# Altium schematic sheet SwitchPower.SchDoc
size A
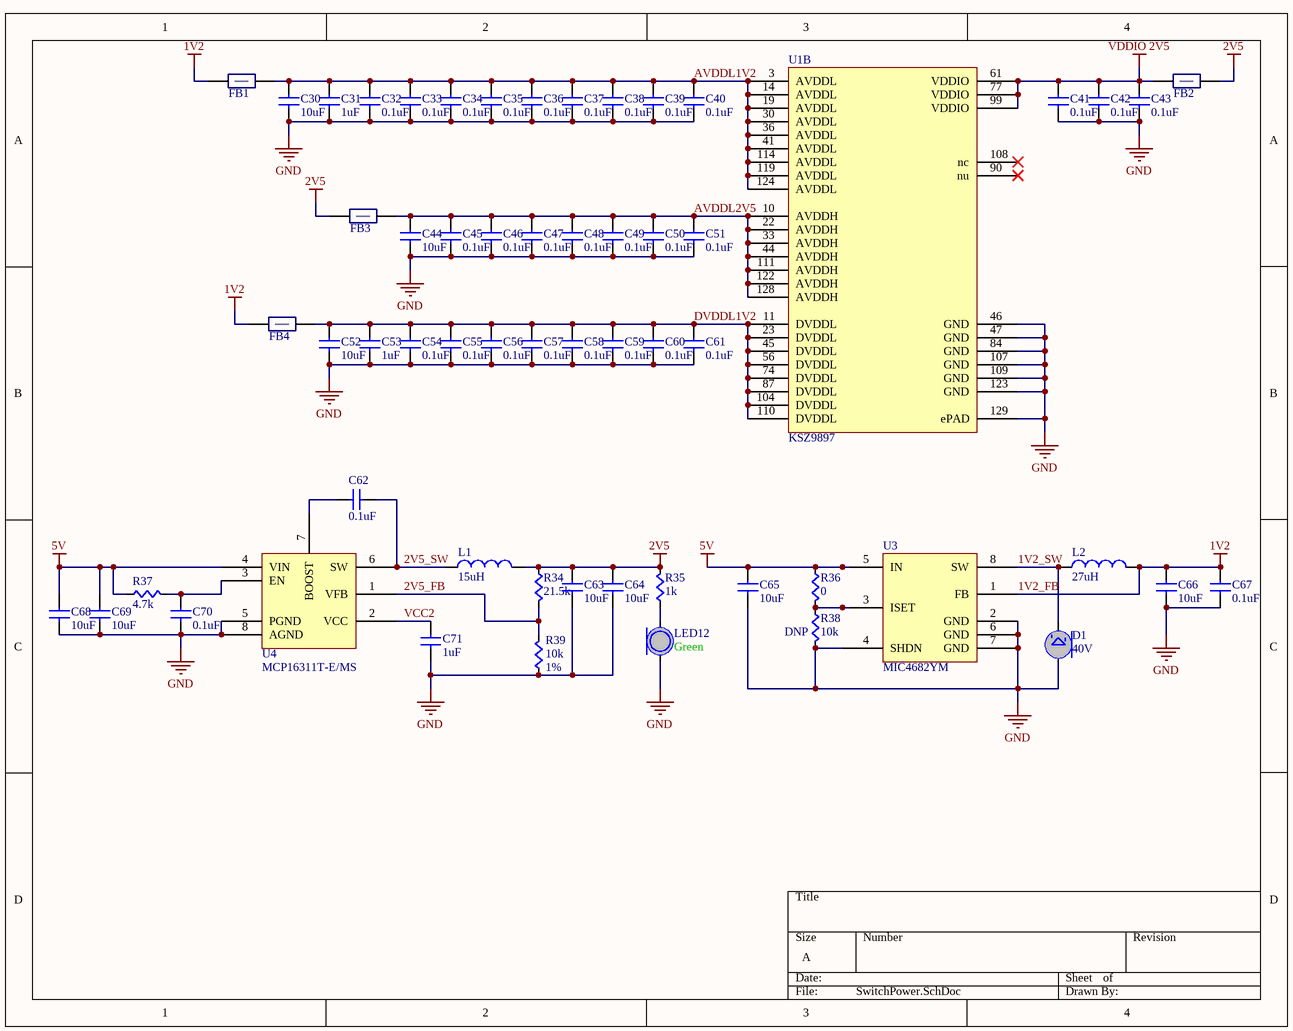
[diagram p0: SwitchPower.SchDoc]

## Parts
C30  value 10uF  [CAPC0603]  (hidden comment: Cap)
C31  value 1uF  [CAPC0603]  (hidden comment: Cap)
C32  value 0.1uF  [CAPC0603]  (hidden comment: Cap)
C33  value 0.1uF  [CAPC0603]  (hidden comment: Cap)
C34  value 0.1uF  [CAPC0603]  (hidden comment: Cap)
C35  value 0.1uF  [CAPC0603]  (hidden comment: Cap)
C36  value 0.1uF  [CAPC0603]  (hidden comment: Cap)
C37  value 0.1uF  [CAPC0603]  (hidden comment: Cap)
C38  value 0.1uF  [CAPC0603]  (hidden comment: Cap)
C39  value 0.1uF  [CAPC0603]  (hidden comment: Cap)
C40  value 0.1uF  [CAPC0603]  (hidden comment: Cap)
C41  value 0.1uF  [CAPC0603]  (hidden comment: Cap)
C42  value 0.1uF  [CAPC0603]  (hidden comment: Cap)
C43  value 0.1uF  [CAPC0603]  (hidden comment: Cap)
C44  value 10uF  [CAPC0603]  (hidden comment: Cap)
C45  value 0.1uF  [CAPC0603]  (hidden comment: Cap)
C46  value 0.1uF  [CAPC0603]  (hidden comment: Cap)
C47  value 0.1uF  [CAPC0603]  (hidden comment: Cap)
C48  value 0.1uF  [CAPC0603]  (hidden comment: Cap)
C49  value 0.1uF  [CAPC0603]  (hidden comment: Cap)
C50  value 0.1uF  [CAPC0603]  (hidden comment: Cap)
C51  value 0.1uF  [CAPC0603]  (hidden comment: Cap)
C52  value 10uF  [CAPC0603]  (hidden comment: Cap)
C53  value 1uF  [CAPC0603]  (hidden comment: Cap)
C54  value 0.1uF  [CAPC0603]  (hidden comment: Cap)
C55  value 0.1uF  [CAPC0603]  (hidden comment: Cap)
C56  value 0.1uF  [CAPC0603]  (hidden comment: Cap)
C57  value 0.1uF  [CAPC0603]  (hidden comment: Cap)
C58  value 0.1uF  [CAPC0603]  (hidden comment: Cap)
C59  value 0.1uF  [CAPC0603]  (hidden comment: Cap)
C60  value 0.1uF  [CAPC0603]  (hidden comment: Cap)
C61  value 0.1uF  [CAPC0603]  (hidden comment: Cap)
C62  value 0.1uF  [CAPC0603]  (hidden comment: Cap)
C63  value 10uF  [CAPC0603]  (hidden comment: Cap)
C64  value 10uF  [CAPC0603]  (hidden comment: Cap)
C65  value 10uF  [CAPC0603]  (hidden comment: Cap)
C66  value 10uF  [CAPC0603]  (hidden comment: Cap)
C67  value 0.1uF  [CAPC0603]  (hidden comment: Cap)
C68  value 10uF  [CAPC0603]  (hidden comment: Cap)
C69  value 10uF  [CAPC0603]  (hidden comment: Cap)
C70  value 0.1uF  [CAPC0603]  (hidden comment: Cap)
C71  value 1uF  [CAPC0603]  (hidden comment: Cap)
D1  Zener Voltage: 40V  [SMASeries]  (hidden comment: Zener)
FB1  FBead  [RES0603]  (value not drawn)
FB2  FBead  [RES0603]  (value not drawn)
FB3  FBead  [RES0603]  (value not drawn)
FB4  FBead  [RES0603]  (value not drawn)
L1  Inductance: 15uH  [RES0603]  (hidden comment: Inductor)
L2  Inductance: 27uH  [RES0603]  (hidden comment: Inductor)
LED12  Color: Green  [LED0603]  (hidden comment: LED)
R34  value 21.5k  [RES0603]  (hidden comment: Res)
R35  value 1k  [RES0603]  (hidden comment: Res)
R36  value 0  [RES0603]  (hidden comment: Res)
R37  value 4.7k  [RES0603]  (hidden comment: Res)
R38  value 10k  [RES0603]  (hidden comment: Res)
R39  value 10k  Tolerance: 1%  [RES0603]  (hidden comment: Res)
U1  KSZ9897  [128-TQFP]  (part B of 2)
U3  MIC4682YM  [8-SOIC]
U4  MCP16311T-E/MS  [TSSOP-8]

## Nets
1V2_FB: C66.1(A) C67.1(A) FB1.1(A) FB4.1(A) L2.2(B) U3.1(FB)  [also labelled 1V2]
2V5: C63.1(A) C64.1(A) FB2.2(B) FB3.1(A) L1.2(B) R34.2(B) R35.1(A)
5V: C65.1(A) C68.1(A) C69.1(A) R36.2(B) R37.2(B) U3.5(IN) U4.4(VIN)
GND: C30.2(B) C31.2(B) C32.2(B) C33.2(B) C34.2(B) C35.2(B) C36.2(B) C37.2(B) C38.2(B) C39.2(B) C40.2(B) C41.2(B) C42.2(B) C43.2(B) C44.2(B) C45.2(B) C46.2(B) C47.2(B) C48.2(B) C49.2(B) C50.2(B) C51.2(B) C52.2(B) C53.2(B) C54.2(B) C55.2(B) C56.2(B) C57.2(B) C58.2(B) C59.2(B) C60.2(B) C61.2(B) C63.2(B) C64.2(B) C65.2(B) C66.2(B) C67.2(B) C68.2(B) C69.2(B) C70.2(B) C71.2(B) D1.A LED12.C R38.1(A) R39.2(B) U1.46(GND) U1.47(GND) U1.84(GND) U1.107(GND) U1.109(GND) U1.123(GND) U1.129(ePAD) U3.2(GND) U3.4(SHDN) U3.6(GND) U3.7(GND) U4.5(PGND) U4.8(AGND)
VDDIO 2V5: C41.1(A) C42.1(A) C43.1(A) FB2.1(A) U1.61(VDDIO) U1.77(VDDIO) U1.99(VDDIO)
1V2_SW: D1.C L2.1(A) U3.8(SW)
2V5_FB: R34.1(A) R39.1(A) U4.1(VFB)
2V5_SW: C62.2(B) L1.1(A) U4.6(SW)
AVDDL1V2: C30.1(A) C31.1(A) C32.1(A) C33.1(A) C34.1(A) C35.1(A) C36.1(A) C37.1(A) C38.1(A) C39.1(A) C40.1(A) FB1.2(B) U1.3(AVDDL) U1.14(AVDDL) U1.19(AVDDL) U1.30(AVDDL) U1.36(AVDDL) U1.41(AVDDL) U1.114(AVDDL) U1.119(AVDDL) U1.124(AVDDL)
AVDDL2V5: C44.1(A) C45.1(A) C46.1(A) C47.1(A) C48.1(A) C49.1(A) C50.1(A) C51.1(A) FB3.2(B) U1.10(AVDDH) U1.22(AVDDH) U1.33(AVDDH) U1.44(AVDDH) U1.111(AVDDH) U1.122(AVDDH) U1.128(AVDDH)
DVDDL1V2: C52.1(A) C53.1(A) C54.1(A) C55.1(A) C56.1(A) C57.1(A) C58.1(A) C59.1(A) C60.1(A) C61.1(A) FB4.2(B) U1.11(DVDDL) U1.23(DVDDL) U1.45(DVDDL) U1.56(DVDDL) U1.74(DVDDL) U1.87(DVDDL) U1.104(DVDDL) U1.110(DVDDL)
VCC2: C71.1(A) U4.2(VCC)
NetC62_1: C62.1(A) U4.7(BOOST)
NetC70_1: C70.1(A) R37.1(A) U4.3(EN)
NetLED12_A: LED12.A R35.2(B)
NetR36_1: R36.1(A) R38.2(B) U3.3(ISET)

Not connected (* = marked no-connect by the designer): U1 90(nu)* 108(nc)*

## Library data of the parts
D1 = Zener: Zener Diode; Supplier 1: Digi-Key; Supplier Part Number 1: CD0603-Z3V3CT-ND
FB1-FB4 = FBead: Ferrite Bead; Supplier 1: Digi-Key; Supplier Part Number 1: 445-2988-1-ND
U1 = KSZ9897RTXC-TR: Ethernet Switch 10/100/1000 Base-T PHY I²C, SPI Interface 128-TQFP (14x14); Supplier 1: Digi-Key; Supplier Part Number 1: KSZ9897RTXC-CT-ND
U3 = MIC4682YM: IC REG BUCK ADJ 2A 8SOIC; Supplier Part Number 1: 576-1802-5-ND; Supplier 1: Digi-Key
U4 = MCP16311T-E/MS: IC REG BUCK ADJ 1A SYNC 8MSOP; Supplier Part Number 1: MCP16311T-E/MSCT-ND; Supplier 1: Digi-Key
C30-C71 = Cap: Supplier 1: Digi-Key
  C30 C44 C52 C63-C66 C68 C69: Supplier Part Number 1: 1276-1119-1-ND
  C31 C53 C71: Supplier Part Number 1: 1276-1946-1-ND
  C32-C43 C45-C51 C54-C62 C67 C70: Supplier Part Number 1: 1276-1000-1-ND
L1 L2 = Inductor: Supplier 1: Digi-Key
  L1: Supplier Part Number 1: 445-6151-1-ND
  L2: Supplier Part Number 1: 535-11596-1-ND
LED12 = LED: Supplier 1: Digi-Key; Supplier Part Number 1: 754-1121-1-ND
R34-R39 = Res: Supplier 1: Digi-Key
  R34: Supplier Part Number 1: RMCF0603FT21K5CT-ND
  R35: Supplier Part Number 1: RMCF0603JT1K00CT-ND
  R36: Supplier Part Number 1: RMCF0603ZT0R00CT-ND
  R37: Supplier Part Number 1: RMCF0603JT4K70CT-ND
  R38: Supplier Part Number 1: RMCF0603JT10K0CT-ND; DNP: DNP
  R39: Supplier Part Number 1: RMCF0603FT10K0CT-ND